# EasyEDA Pro project 两轮差速平衡小车.epro

# Schematic Schematic1
Board Name: Board1; Create Date: 2025-07-21; Page Name: P1; Project Name: New Project_2025-07-21_21-23-00; Schematic Name: Schematic1; Update Date: 2025-07-30; Company: 嘉立创EDA; Page Size: A4; Version: V1.0
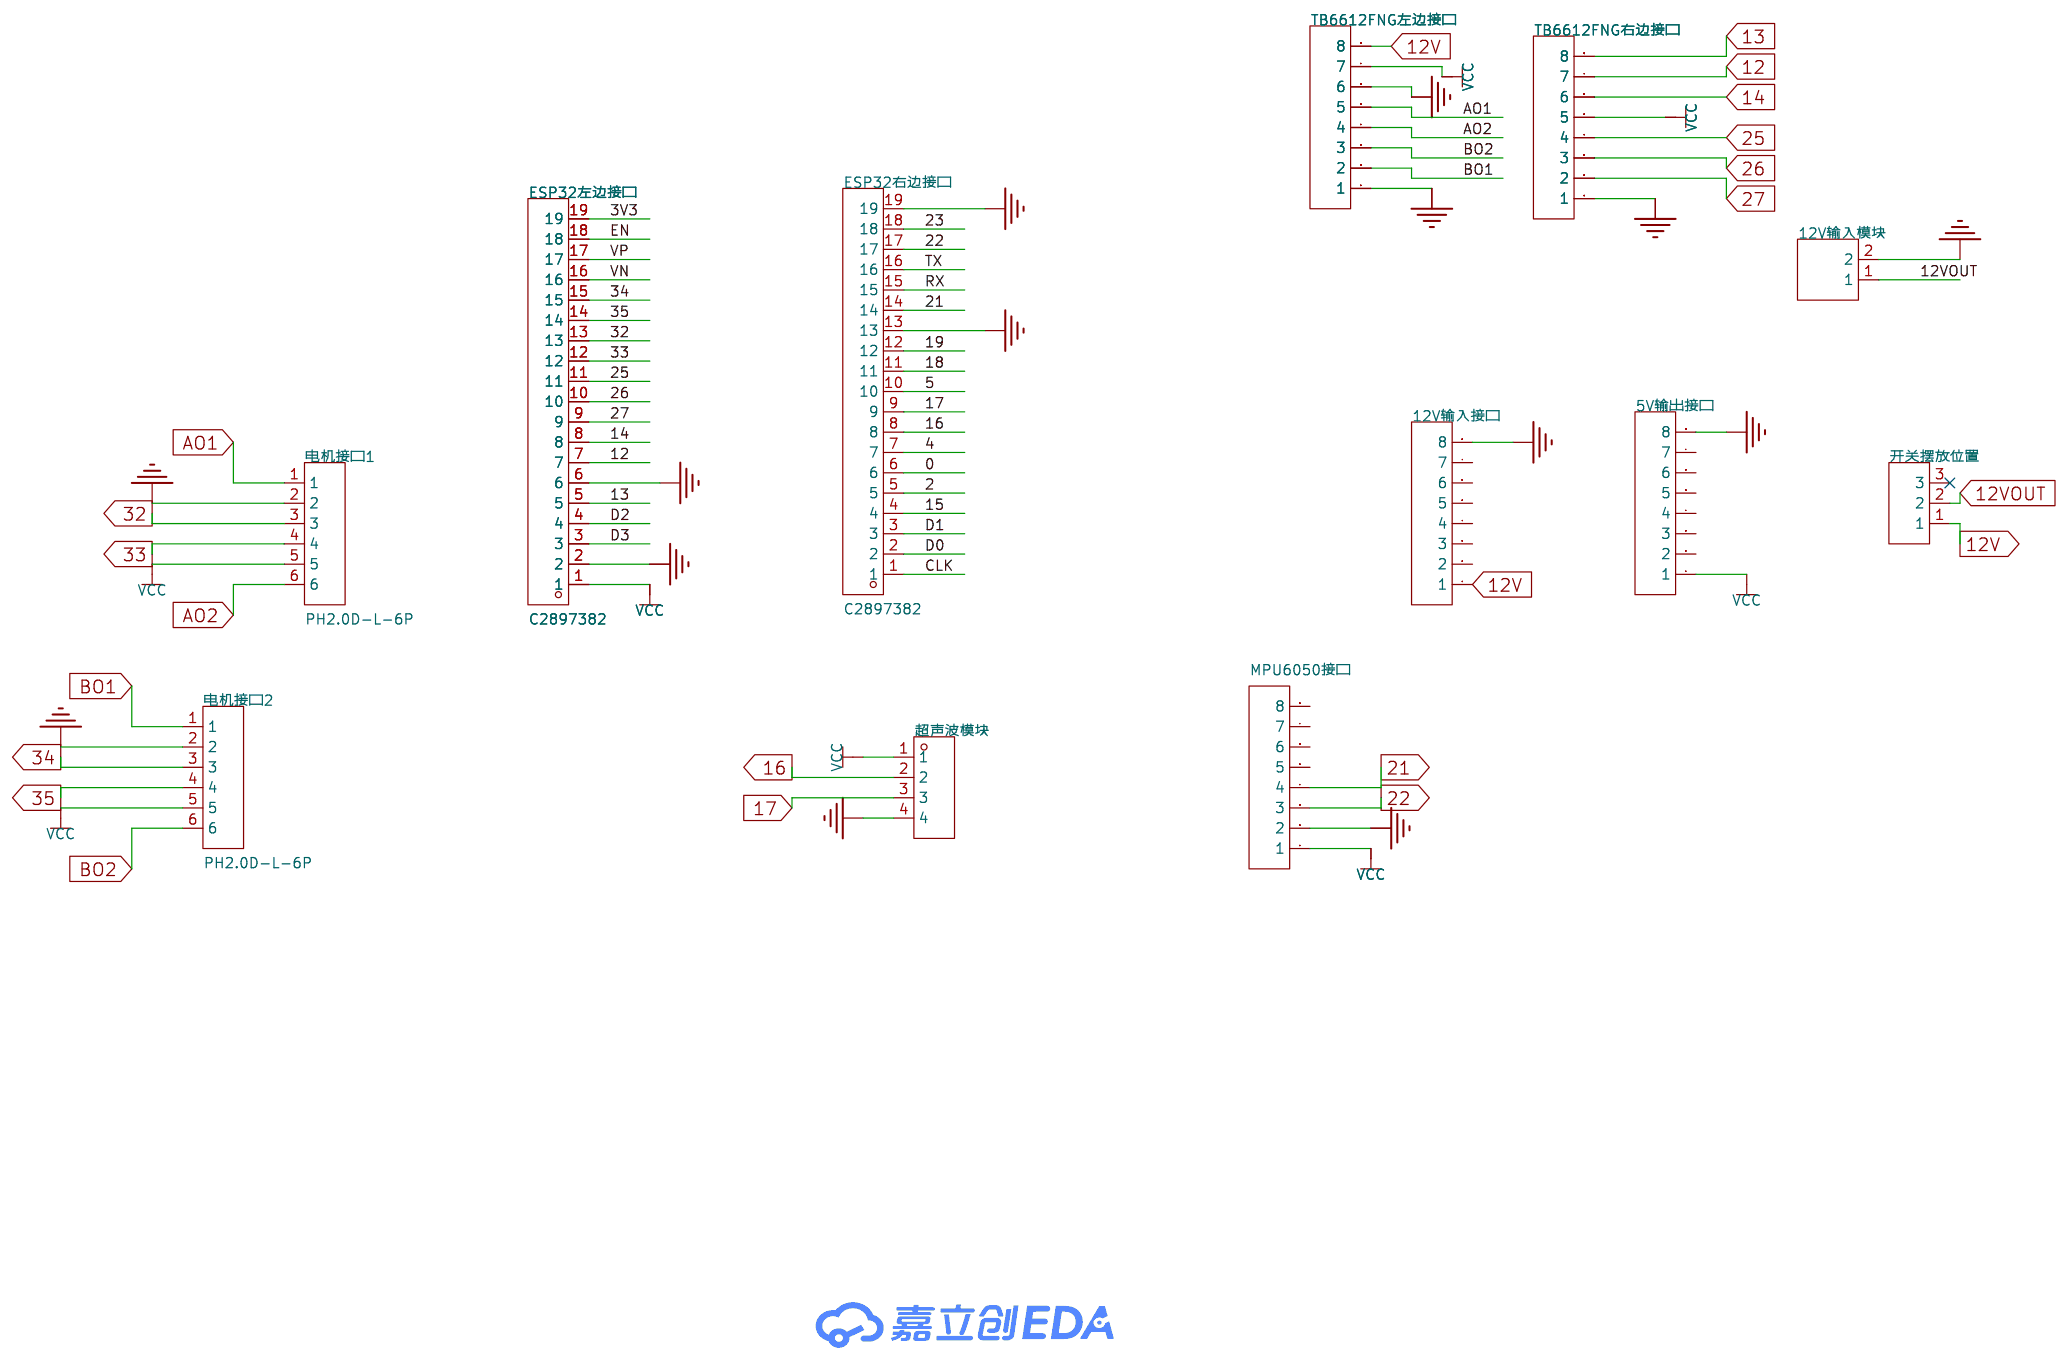
[diagram p0: schematic sheet]

## Parts
5V输出接口  -  [HDR-TH_8P-P2.54-V-F-1]
12V输入接口  -  [HDR-TH_8P-P2.54-V-F-1]
12V输入模块  -  [HDR-TH_2P-P2.54-V-M-1]
ESP32右边接口  C2897382  [HDR-TH_19P-P2.54-V-F]
ESP32左边接口  C2897382  [HDR-TH_19P-P2.54-V-F]
MPU6050接口  -  [HDR-TH_8P-P2.54-V-F-1]
TB6612FNG右边接口  -  [HDR-TH_8P-P2.54-V-F-1]
TB6612FNG左边接口  -  [HDR-TH_8P-P2.54-V-F-1]
开关摆放位置  -  [HDR-TH_3P-P2.54-V-F]
电机接口1  PH2.0D-L-6P  [CONN-TH_6P_PH2.0D-L-6P]
电机接口2  PH2.0D-L-6P  [CONN-TH_6P_PH2.0D-L-6P]
超声波模块  -  [HDR-TH_4P-P2.54-V-F]

## Library data of the parts
5V输出接口 12V输入接口 MPU6050接口 TB6612FNG右边接口 TB6612FNG左边接口 = HDR-F_2.54_1x8P: Supplier Part: C27438; Supplier Footprint: 插件
12V输入模块 = HDR-M_2.54_1x2P: Supplier Part: C124375; Supplier Footprint: 插件
ESP32右边接口 ESP32左边接口 = HDR-F_2.54_1x19P: Supplier Footprint: 插件
开关摆放位置 = HDR-F_2.54_1x3P: Supplier Part: C541850; Supplier Footprint: 插件
电机接口1 电机接口2 = PH2.0D-L-6P: Supplier Part: C9900007791; Supplier Footprint: PH-6A(RED); JLCPCB Part Class: 扩展库; Supplier: LCSC
超声波模块 = HDR-F_2.54_1x4P: Supplier Part: C2718488; Supplier Footprint: 插件

## Nets
3V3: ESP32左边接口.19
12V: 12V输入接口.1 TB6612FNG左边接口.8 开关摆放位置.1
12VOUT: 12V输入模块.1 开关摆放位置.2
GND: 5V输出接口.8 12V输入接口.8 12V输入模块.2 ESP32右边接口.13 ESP32右边接口.19 ESP32左边接口.2 ESP32左边接口.6 MPU6050接口.2 TB6612FNG右边接口.1 TB6612FNG左边接口.1 TB6612FNG左边接口.6 电机接口1.2 电机接口2.2 超声波模块.4
VCC: 5V输出接口.1 ESP32左边接口.1 MPU6050接口.1 TB6612FNG右边接口.5 TB6612FNG左边接口.7 电机接口1.5 电机接口2.5 超声波模块.1
0: ESP32右边接口.6
2: ESP32右边接口.5
4: ESP32右边接口.7
5: ESP32右边接口.10
12: ESP32左边接口.7 TB6612FNG右边接口.7
13: ESP32左边接口.5 TB6612FNG右边接口.8
14: ESP32左边接口.8 TB6612FNG右边接口.6
15: ESP32右边接口.4
16: ESP32右边接口.8 超声波模块.2
17: ESP32右边接口.9 超声波模块.3
18: ESP32右边接口.11
19: ESP32右边接口.12
21: ESP32右边接口.14 MPU6050接口.4
22: ESP32右边接口.17 MPU6050接口.3
23: ESP32右边接口.18
25: ESP32左边接口.11 TB6612FNG右边接口.4
26: ESP32左边接口.10 TB6612FNG右边接口.3
27: ESP32左边接口.9 TB6612FNG右边接口.2
32: ESP32左边接口.13 电机接口1.3
33: ESP32左边接口.12 电机接口1.4
34: ESP32左边接口.15 电机接口2.3
35: ESP32左边接口.14 电机接口2.4
AO1: TB6612FNG左边接口.5 电机接口1.1
AO2: TB6612FNG左边接口.4 电机接口1.6
BO1: TB6612FNG左边接口.2 电机接口2.1
BO2: TB6612FNG左边接口.3 电机接口2.6
CLK: ESP32右边接口.1
D0: ESP32右边接口.2
D1: ESP32右边接口.3
D2: ESP32左边接口.4
D3: ESP32左边接口.3
EN: ESP32左边接口.18
RX: ESP32右边接口.15
TX: ESP32右边接口.16
VN: ESP32左边接口.16
VP: ESP32左边接口.17

Not connected (* = marked no-connect by the designer): 5V输出接口 2 3 4 5 6 7; 12V输入接口 2 3 4 5 6 7; MPU6050接口 5 6 7 8; 开关摆放位置 3*

# Board PCB1
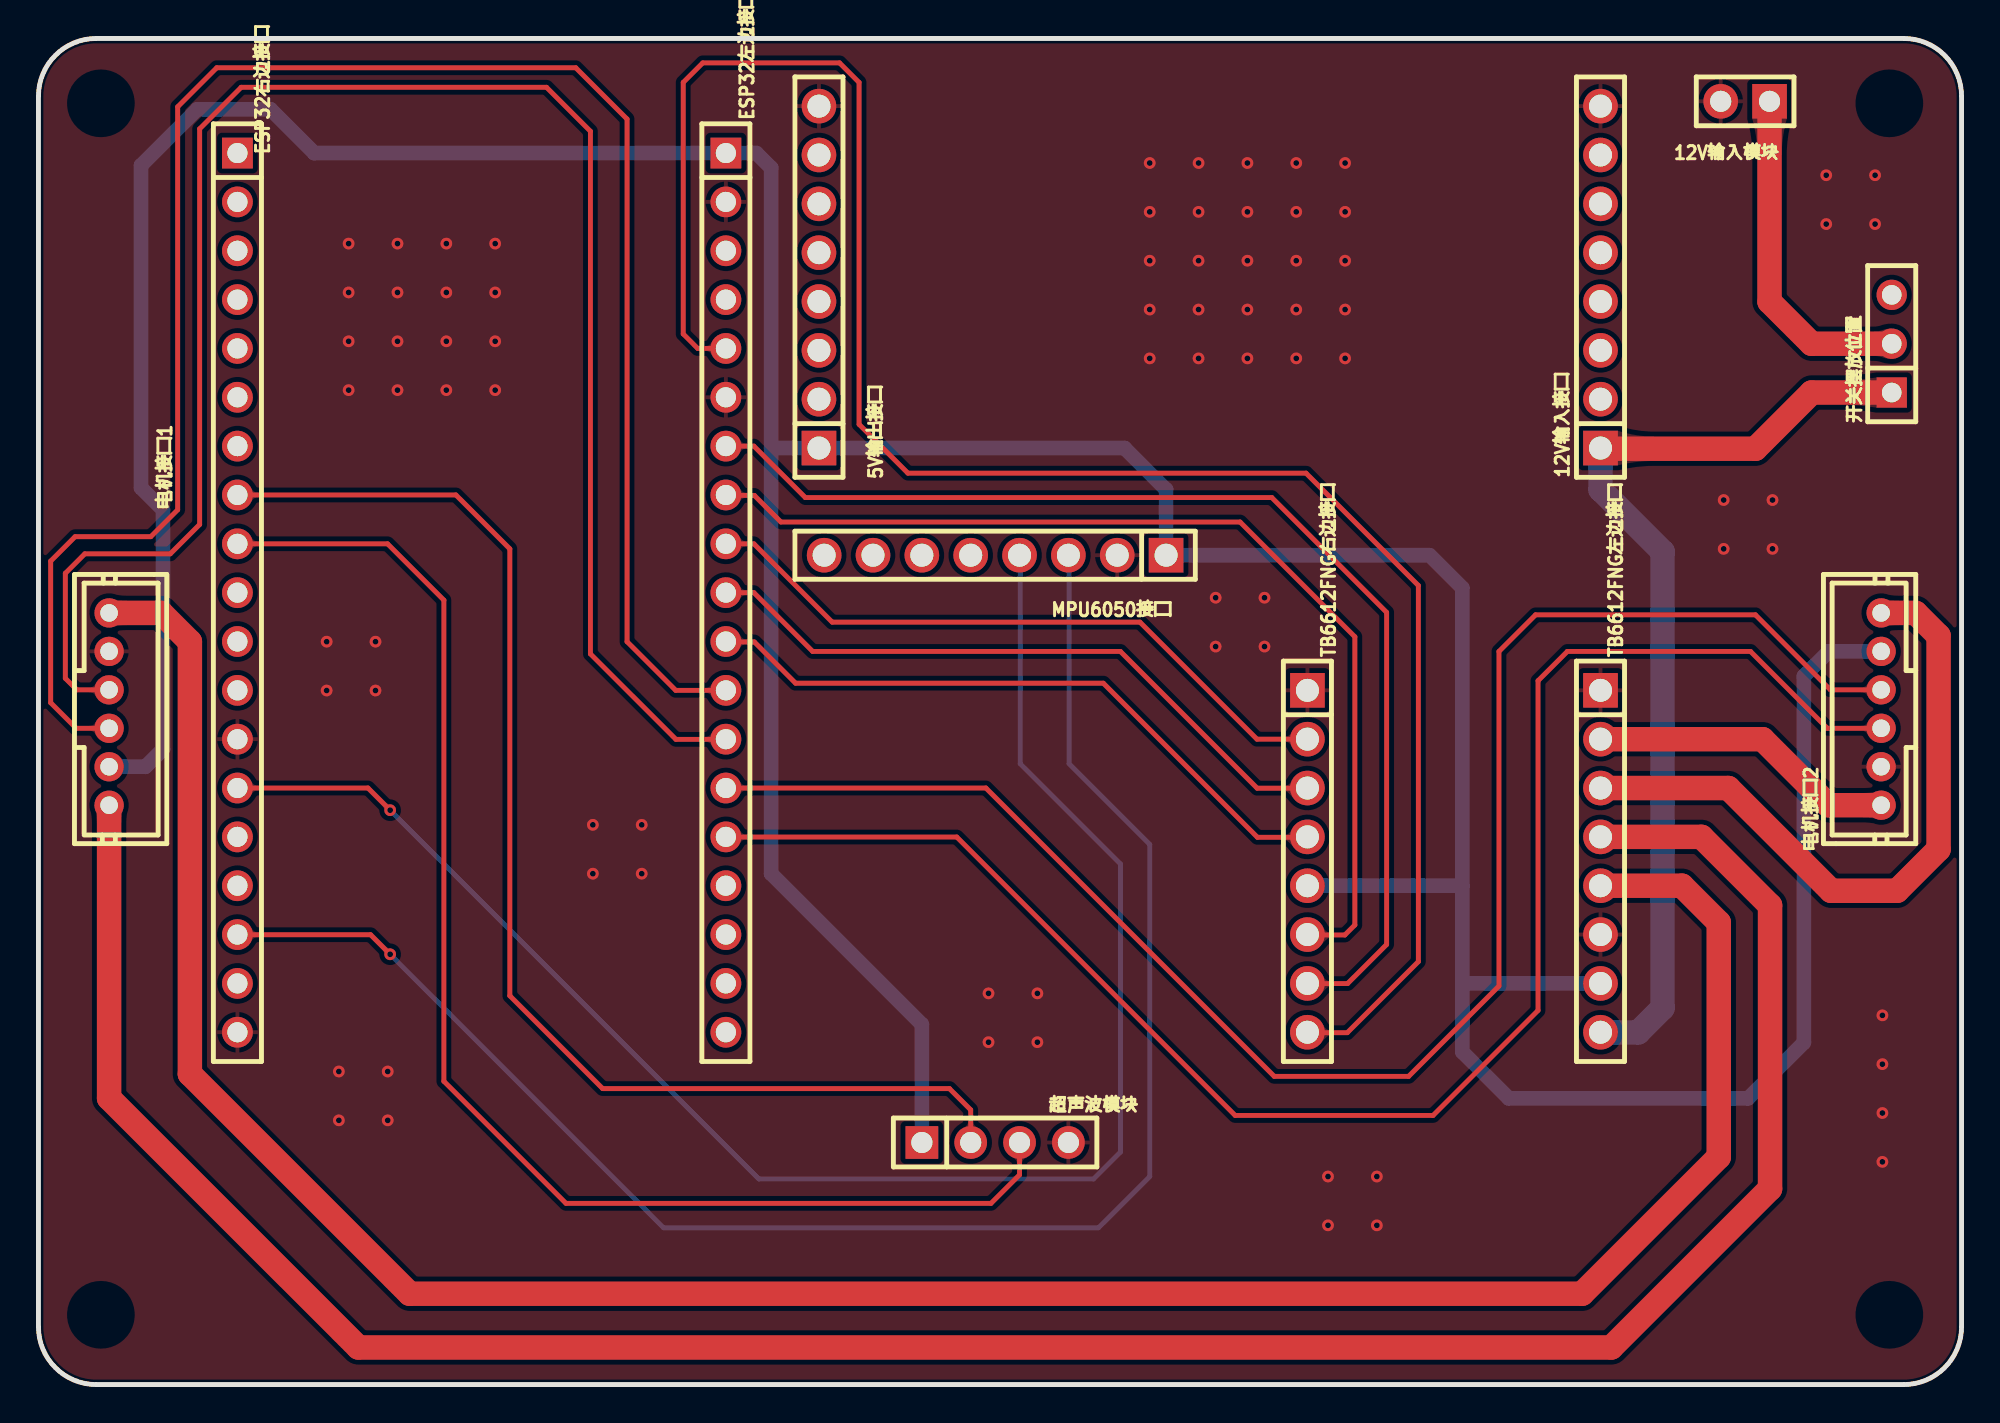
[diagram p1: board, top side]
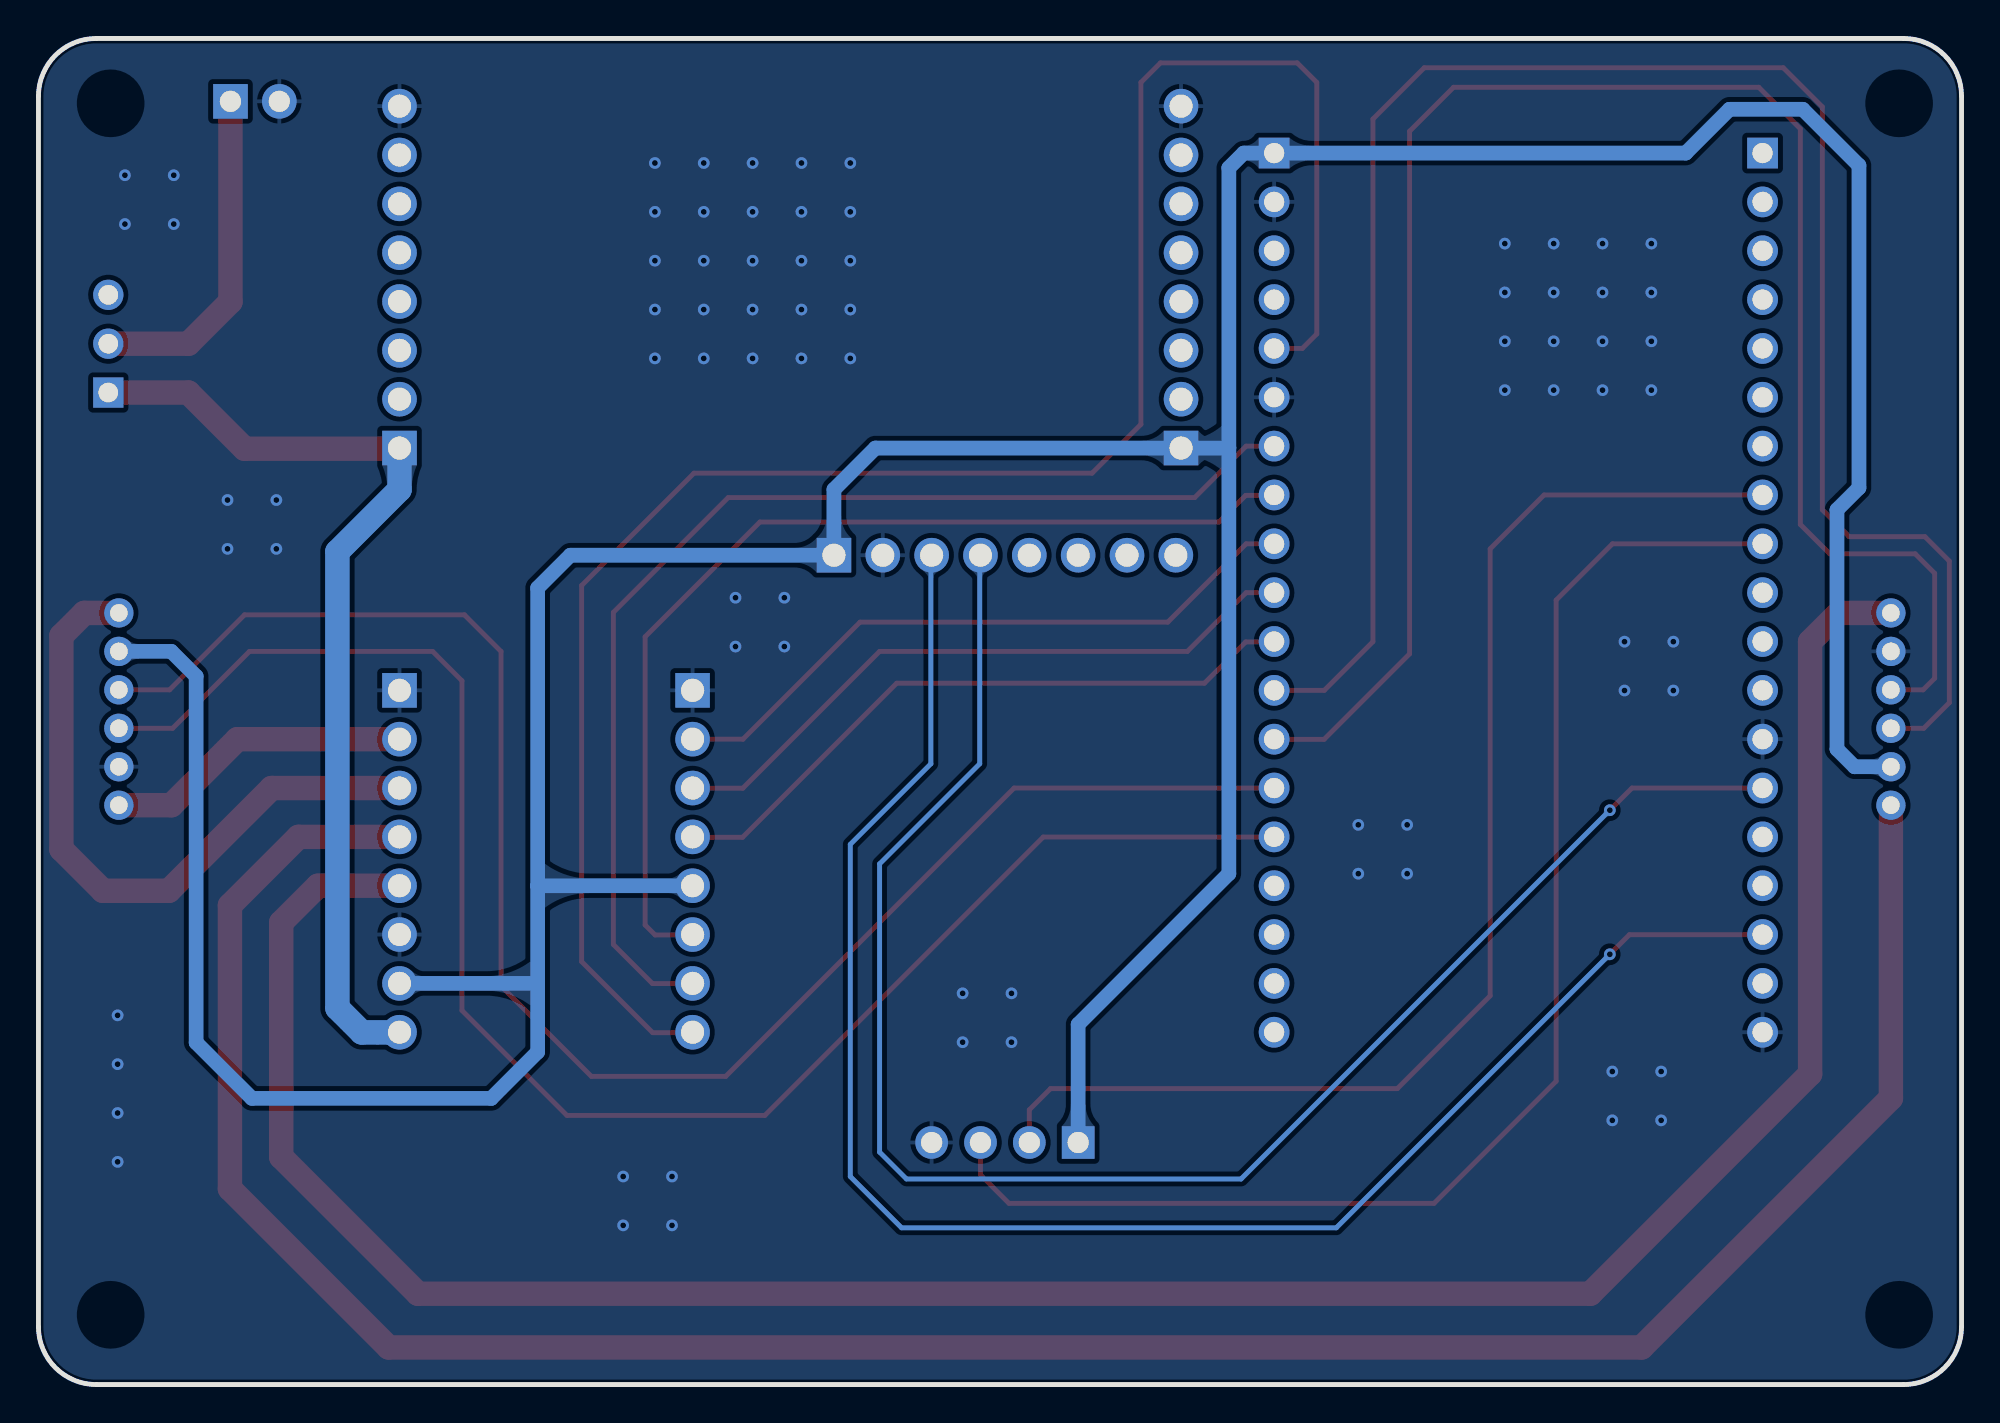
[diagram p2: board, bottom side, seen from below]

Outline 100 x 70 mm; copper layers: Top Layer, Bottom Layer. Coordinates in mm from the lower left corner of the outline.
Outline path: 0,67 0,3 arc(0.88,0.88) 3,0 97,0 arc(99.12,0.88) 100,3 100,67 arc(99.12,69.12) 97,70 3,70 arc(0.88,69.12) 0,67
Stack: Top Layer 0.035mm / Dielectric1 1.51mm FR4 er 4.5 / Bottom Layer 0.035mm

## Design rules (mm)
template: JLCPCB Capability(Two Layers Board)
spacing copperThickness1oz (default): track to track 0.102, other pairs 0.152 to 0.3
spacing copperThickness2oz: track to track 0.203, other pairs 0.152 to 0.3
track width copperThickness1oz (default): min 0.127, default 0.254, max 2.54
track width copperThickness2oz: min 0.203, default 0.254, max 2.54
differential pair differentialPair (default): width min 0.127, default 0.254, max 2.54; gap min 0.152, default 0.152
via viaSize (default): diameter min 0.5, default 0.61, max 10; hole min 0.3, default 0.305, max 6.3

## Placement (name value [footprint] x y rotation side)
5V输出接口  -  [HDR-TH_8P-P2.54-V-F-1]  40.59 57.59 90 top
12V输入接口  -  [HDR-TH_8P-P2.54-V-F-1]  81.23 57.59 90 top
12V输入模块  -  [HDR-TH_2P-P2.54-V-M-1]  88.75 66.73 180 top
ESP32右边接口  C2897382  [HDR-TH_19P-P2.54-V-F]  10.35 41.18 270 top
ESP32左边接口  C2897382  [HDR-TH_19P-P2.54-V-F]  35.75 41.18 270 top
MPU6050接口  -  [HDR-TH_8P-P2.54-V-F-1]  49.75 43.13 180 top
TB6612FNG右边接口  -  [HDR-TH_8P-P2.54-V-F-1]  65.99 27.21 270 top
TB6612FNG左边接口  -  [HDR-TH_8P-P2.54-V-F-1]  81.23 27.21 270 top
开关摆放位置  -  [HDR-TH_3P-P2.54-V-F]  96.37 54.13 90 top
电机接口1  PH2.0D-L-6P  [CONN-TH_6P_PH2.0D-L-6P]  3.67 35.13 270 top
电机接口2  PH2.0D-L-6P  [CONN-TH_6P_PH2.0D-L-6P]  95.82 35.13 90 top
超声波模块  -  [HDR-TH_4P-P2.54-V-F]  49.75 12.59 0 top

## Footprints (pads in the part's own frame, mm; a bottom-side part is the same pattern mirrored in y, then rotated)
CONN-TH_6P_PH2.0D-L-6P
  round 1.524 hole 0.914: 1(-5,0) 2(-3,0) 3(-1,0) 4(1,0) 5(3,0) 6(5,0)
HDR-TH_2P-P2.54-V-M-1
  rect 1.8x1.8 hole 1.1: 1(-1.27,0)
  round 1.8 hole 1.1: 2(1.27,0)
HDR-TH_3P-P2.54-V-F
  rect 1.575x1.575 hole 1.02: 1(-2.54,0)
  round 1.575 hole 1.02: 2(0,0) 3(2.54,0)
HDR-TH_4P-P2.54-V-F
  rect 1.7x1.7 hole 1.1: 1(-3.81,0)
  round 1.7 hole 1.1: 2(-1.27,0) 3(1.27,0) 4(3.81,0)
HDR-TH_8P-P2.54-V-F-1
  rect 1.8x1.8 hole 1.2: 1(-8.89,0)
  round 1.8 hole 1.2: 2(-6.35,0) 3(-3.81,0) 4(-1.27,0) 5(1.27,0) 6(3.81,0) 7(6.35,0) 8(8.89,0)
HDR-TH_19P-P2.54-V-F
  rect 1.6x1.6 hole 1.05: 1(-22.86,0)
  round 1.6 hole 1.05: 2(-20.32,0) 3(-17.78,0) 4(-15.24,0) 5(-12.7,0) 6(-10.16,0) 7(-7.62,0) 8(-5.08,0) 9(-2.54,0) 10(0,0) 11(2.54,0) 12(5.08,0) 13(7.62,0) 14(10.16,0) 15(12.7,0) 16(15.24,0) 17(17.78,0) 18(20.32,0) 19(22.86,0)

## Nets
As in the schematic.

Pads without a net: 5V输出接口 2 3 4 5 6 7; 12V输入接口 2 3 4 5 6 7; MPU6050接口 5 6 7 8; 开关摆放位置 3

## Via types
v1: diameter 0.61, hole 0.305, Top Layer to Bottom Layer, 79 vias

## Routing (per net, layer and track width the routed paths; a pad name or vN(x,y) marks a point on that pad's centre or on a via; arc(x,y) is an arc through that point)
12V: length 50.6
  Top Layer w1.27: 12V输入接口.1 81.26,48.66 89.28,48.66 92.2,51.59 开关摆放位置.1
  Bottom Layer w1.27: 12V输入接口.1 81.23,46.54 84.45,43.31 84.45,19.58 83.18,18.31 81.23,18.31 TB6612FNG左边接口.8
12VOUT: length 17.7
  Top Layer w1.27: 开关摆放位置.2 96.37,54.13 92.2,54.13 90.02,56.31 12V输入模块.1
GND:
  vias: v1(14.99,38.63) v1(14.99,36.09) v1(15.62,16.28) v1(15.62,13.74) v1(16.13,59.33) v1(16.13,56.79) v1(16.13,54.25) v1(16.13,51.71) v1(17.53,38.63) v1(17.53,36.09) v1(18.16,16.28) v1(18.16,13.74) v1(18.67,59.33) v1(18.67,56.79) v1(18.67,54.25) v1(18.67,51.71) v1(21.21,59.33) v1(21.21,56.79) v1(21.21,54.25) v1(21.21,51.71) v1(23.75,59.33) v1(23.75,56.79) v1(23.75,54.25) v1(23.75,51.71) v1(28.83,29.11) v1(28.83,26.57) v1(31.37,29.11) v1(31.37,26.57) v1(49.4,20.34) v1(49.4,17.8) v1(51.94,20.34) v1(51.94,17.8) v1(57.78,63.52) v1(57.78,60.98) v1(57.78,58.44) v1(57.78,55.9) v1(57.78,53.36) v1(60.33,63.52) v1(60.33,60.98) v1(60.33,58.44) v1(60.33,55.9) v1(60.33,53.36) v1(61.21,40.92) v1(61.21,38.38) v1(62.86,63.52) v1(62.86,60.98) v1(62.86,58.44) v1(62.86,55.9) v1(62.86,53.36) v1(63.75,40.92) v1(63.75,38.38) v1(65.4,63.52) v1(65.4,60.98) v1(65.4,58.44) v1(65.4,55.9) v1(65.4,53.36) v1(67.06,10.82) v1(67.06,8.28) v1(67.95,63.52) v1(67.95,60.98) v1(67.95,58.44) v1(67.95,55.9) v1(67.95,53.36) v1(69.6,10.82) v1(69.6,8.28) v1(87.63,46) v1(87.63,43.46) v1(90.17,46) v1(90.17,43.46) v1(92.96,62.89) v1(92.96,60.35) v1(95.5,62.89) v1(95.5,60.35) v1(95.89,19.2) v1(95.89,16.66) v1(95.89,14.12) v1(95.89,11.58)
VCC: length 247.1
  Bottom Layer w0.762: 74.05,20.86 74.04,20.87 74.04,25.93 ; 74.05,20.86 TB6612FNG左边接口.7 ; 74.05,20.86 74.04,20.85 74.04,17.3 76.45,14.88 88.9,14.88 91.8,17.78 91.8,36.83 93.09,38.13 电机接口2.5 ; 74.04,25.93 74.04,41.43 72.34,43.13 MPU6050接口.1 58.64,46.54 56.48,48.7 5V输出接口.1 38.11,48.7 38.1,48.71 ; 74.04,25.93 74.03,25.94 TB6612FNG右边接口.5 ; 38.1,48.71 38.1,26.57 45.94,18.73 超声波模块.1 ; 38.1,48.71 38.1,63.27 37.33,64.04 ESP32左边接口.1 14.34,64.04 12.06,66.32 8.25,66.32 5.33,63.4 5.33,46.63 6.48,45.49 6.48,33.04 5.56,32.13 电机接口1.5
12: length 60.2
  Top Layer w0.254: ESP32左边接口.7 37.2,48.8 39.88,46.12 64.14,46.12 70.1,40.16 70.1,22.88 68.07,20.85 65.99,20.85
13: length 102.8
  Top Layer w0.254: ESP32左边接口.5 34.28,53.88 33.53,54.63 33.53,67.71 34.54,68.73 41.66,68.73 42.67,67.71 42.67,49.93 45.21,47.39 65.91,47.39 71.75,41.55 71.75,21.99 68.06,18.3 65.99,18.3
14: length 53.4
  Top Layer w0.254: 35.75,46.24 37.22,46.24 38.61,44.85 62.48,44.85 68.45,38.89 68.45,23.9 67.93,23.38 65.99,23.38
16: length 66.7
  Top Layer w0.254: 超声波模块.2 48.48,14.29 47.37,15.39 29.34,15.39 24.51,20.22 24.51,43.46 21.71,46.26 ESP32右边接口.8
17: length 71.8
  Top Layer w0.254: ESP32右边接口.9 18.15,43.72 21.08,40.79 21.08,15.77 27.43,9.42 49.53,9.42 51.02,10.91 超声波模块.3
21: length 88.1
  Top Layer w0.254: ESP32右边接口.14 17.14,31.02 v1(18.29,29.87)
  Bottom Layer w0.254: v1(18.29,29.87) 37.46,10.69 54.86,10.69 56.26,12.09 56.26,27.07 51.05,32.28 51.05,43.09 MPU6050接口.4
22: length 88.9
  Top Layer w0.254: ESP32右边接口.17 10.35,23.39 17.27,23.39 v1(18.29,22.38)
  Bottom Layer w0.254: v1(18.29,22.38) 32.51,8.15 55.12,8.15 57.78,10.82 57.78,28.09 53.59,32.28 53.59,43.09 MPU6050接口.3
25: length 34.4
  Top Layer w0.254: 65.99,28.46 63.39,28.46 55.37,36.47 39.37,36.47 37.22,38.62 35.75,38.62
26: length 34.5
  Top Layer w0.254: ESP32左边接口.10 37.2,41.18 40.26,38.12 56.26,38.12 63.37,31.01 65.98,31.01 TB6612FNG右边接口.3
27: length 34.4
  Top Layer w0.254: TB6612FNG右边接口.2 63.36,33.56 57.28,39.65 41.27,39.65 37.2,43.72 ESP32左边接口.9
32: length 94.8
  Top Layer w0.254: 电机接口1.3 2,36.13 1.4,36.73 1.4,42.19 2.41,43.2 6.85,43.2 8.38,44.73 8.38,65.3 10.54,67.46 26.42,67.46 28.7,65.17 28.7,38 33.15,33.55 35.74,33.55 ESP32左边接口.13
33: length 98.3
  Top Layer w0.254: ESP32左边接口.12 33.14,36.1 30.61,38.63 30.61,65.81 27.94,68.48 9.27,68.48 7.24,66.44 7.24,45.49 5.84,44.09 1.91,44.09 0.63,42.82 0.63,35.46 1.96,34.13 电机接口1.4
34: length 87.8
  Top Layer w0.254: ESP32左边接口.15 35.75,28.47 47.75,28.47 62.23,13.99 72.52,13.99 77.98,19.45 77.98,36.6 79.5,38.12 89.03,38.12 93.02,34.13 电机接口2.3
35: length 88
  Top Layer w0.254: 电机接口2.4 93.18,36.13 89.28,40.03 77.85,40.03 75.95,38.12 75.95,20.72 71.25,16.03 64.26,16.03 49.27,31.02 ESP32左边接口.14
AO1: length 133.6
  Top Layer w1.27: TB6612FNG左边接口.5 85.46,25.94 87.38,24.03 87.38,11.83 80.26,4.72 19.3,4.72 7.87,16.15 7.87,38.63 6.38,40.13 电机接口1.1
AO2: length 135.4
  Top Layer w1.27: TB6612FNG左边接口.4 86.48,28.48 90.04,24.92 90.04,10.18 81.79,1.93 16.64,1.93 3.67,14.89 电机接口1.6
BO1: length 16
  Top Layer w1.27: 电机接口2.1 93.09,30.13 89.65,33.56 TB6612FNG左边接口.2
BO2: length 35.3
  Top Layer w1.27: TB6612FNG左边接口.3 87.87,31.02 93.22,25.68 96.65,25.68 98.81,27.84 98.81,38.94 97.61,40.13 电机接口2.6

## Copper pours and planes (outline as drawn; the poured copper is in the pictures)
GND on Top Layer: -5.72,75.08 111.25,75.08 111.25,-9.63 -5.72,-9.63
GND on Bottom Layer: -9.14,78.64 116.71,78.64 116.71,-15.34 -9.14,-15.34

Small or netless copper shapes (teardrops, artwork), in the pictures only: 40 on Top Layer, 20 on Bottom Layer
